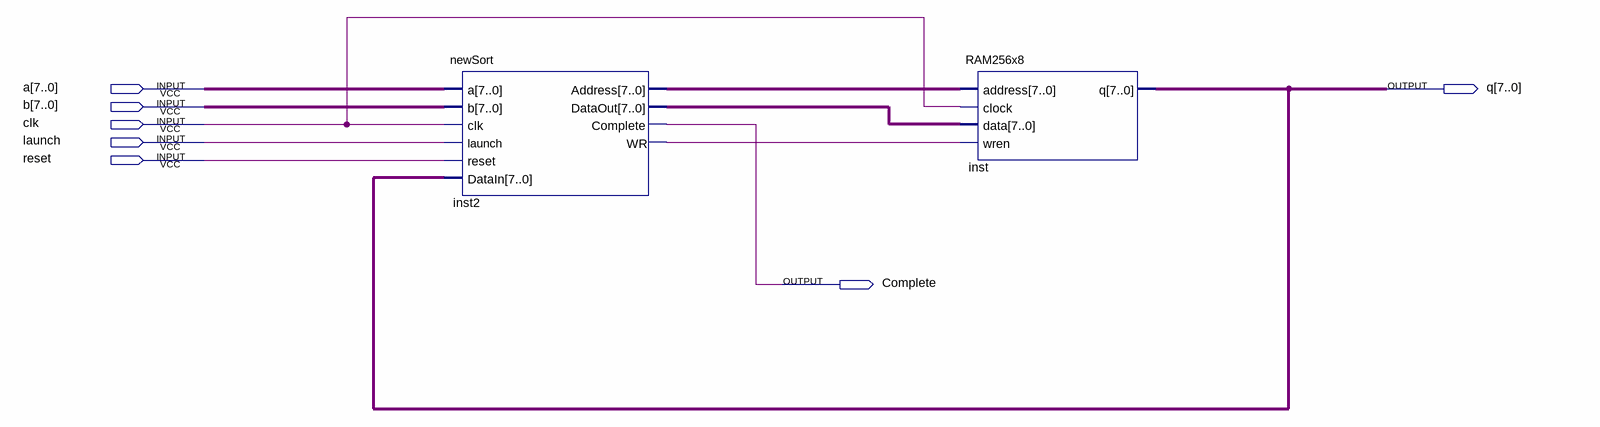
[diagram p0: schematic sheet]
// Quartus schematic newSorter.bdf as structural Verilog: 2 symbols, 7 pins
module newSorter (
  input  [7:0] a,
  input  [7:0] b,
  input  clk,
  input  launch,
  input  reset,
  output [7:0] q,
  output Complete
);

  wire inst2_wr;
  wire [7:0] inst2_address, inst2_dataout;

  newSort inst2 (
    .a(a), .b(b), .clk(clk), .launch(launch), .reset(reset), .DataIn(q), .Address(inst2_address),
    .DataOut(inst2_dataout), .Complete(Complete), .WR(inst2_wr));
  RAM256x8 inst (.address(inst2_address), .clock(clk), .data(inst2_dataout), .wren(inst2_wr), .q(q));
endmodule
